# Altium project ADS1274.PrjPcb
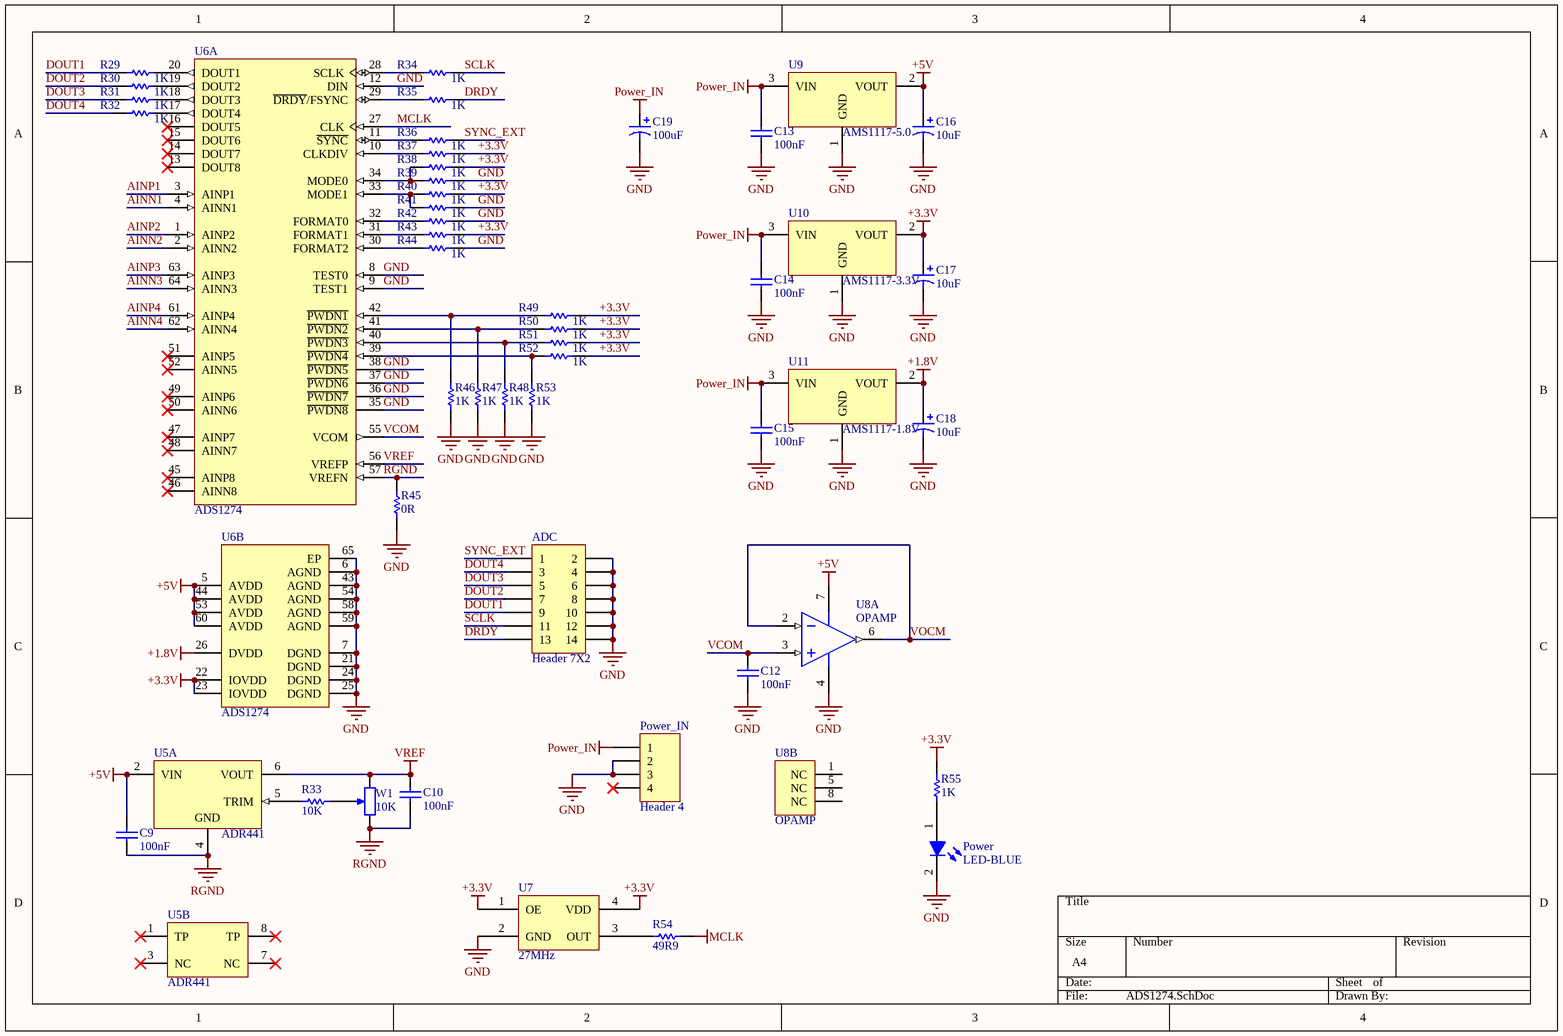
[diagram p0: ADS1274.SchDoc]
3 sheets, 108 parts. Net scope: global (net labels, ports and power ports of the same name join across sheets).
Board file: ADS1274.PcbDoc
Sheets:
  ADS1274.SchDoc
  Diff AMP Inputs.SchDoc
  Decoupling Caps.SchDoc

## Sheet ADS1274.SchDoc
size A4

### Parts
ADC  Header 7X2  [HEADER7X2]
C9  100nF  [CAPC0603(1608)55_M]
C10  100nF  [CAPC0603(1608)55_M]
C12  100nF  [CAPC0603(1608)55_M]
C13  100nF  [CAPC0603(1608)55_M]
C14  100nF  [CAPC0603(1608)55_M]
C15  100nF  [CAPC0603(1608)55_M]
C16  10uF  [CAPC3528]
C17  10uF  [CAPC3528]
C18  10uF  [CAPC3528]
C19  100uF  [CAPC7343]
Power  LED-BLUE  [0603LED_BLUE_V]
Power_IN  Header 4  [3.96-4]
R29  1K  [RESC0603(1608)_M]
R30  1K  [RESC0603(1608)_M]
R31  1K  [RESC0603(1608)_M]
R32  1K  [RESC0603(1608)_M]
R33  10K  [RESC0603(1608)_M]
R34  1K  [RESC0603(1608)_M]
R35  1K  [RESC0603(1608)_M]
R36  1K  [RESC0603(1608)_M]
R37  1K  [RESC0603(1608)_M]
R38  1K  [RESC0603(1608)_M]
R39  1K  [RESC0603(1608)_M]
R40  1K  [RESC0603(1608)_M]
R41  1K  [RESC0603(1608)_M]
R42  1K  [RESC0603(1608)_M]
R43  1K  [RESC0603(1608)_M]
R44  1K  [RESC0603(1608)_M]
R45  0R  [RESC0603(1608)_M]
R46  1K  [RESC0603(1608)_M]
R47  1K  [RESC0603(1608)_M]
R48  1K  [RESC0603(1608)_M]
R49  1K  [RESC0603(1608)_M]
R50  1K  [RESC0603(1608)_M]
R51  1K  [RESC0603(1608)_M]
R52  1K  [RESC0603(1608)_M]
R53  1K  [RESC0603(1608)_M]
R54  49R9  [RESC0603(1608)_M]
R55  1K  [RESC0603(1608)_M]
U5  ADR441  [SOIC8]  (parts A,B of 2)
U6  ADS1274  [EQFP64]  (parts A,B of 2)
U7  27MHz  [SMD7050]
U8  OPAMP  [SOIC8]  (parts A,B of 2)
U9  AMS1117-5.0  [SOT-223_M]
U10  AMS1117-3.3V  [SOT-223_M]
U11  AMS1117-1.8V  [SOT-223_M]
W1  10K  [VR5]

### Nets
+1.8V: C18.1 U6.26(DVDD) U11.2(VOUT)
+3.3V: C17.1 R37.2 R38.2 R40.2 R43.2 R49.2 R50.2 R51.2 R52.2 R55.2 U6.22(IOVDD) U6.23(IOVDD) U7.1(OE) U7.4(VDD) U10.2(VOUT)
+5V: C9.2 C16.1 U5.2(VIN) U6.5(AVDD) U6.44(AVDD) U6.53(AVDD) U6.60(AVDD) U8.7(V+) U9.2(VOUT)
GND: ADC.2 ADC.4 ADC.6 ADC.8 ADC.10 ADC.12 ADC.14 C12.1 C13.1 C14.1 C15.1 C16.2 C17.2 C18.2 C19.2 Power.2(K) Power_IN.2 Power_IN.3 R39.2 R41.2 R42.2 R44.2 R45.1 R46.1 R47.1 R48.1 R53.1 U6.6(AGND) U6.7(DGND) U6.8(TEST0) U6.9(TEST1) U6.12(DIN) U6.21(DGND) U6.24(DGND) U6.25(DGND) U6.35(~{PWDN8}) U6.36(~{PWDN7}) U6.37(~{PWDN6}) U6.38(~{PWDN5}) U6.43(AGND) U6.54(AGND) U6.58(AGND) U6.59(AGND) U6.65(EP) U7.2(GND) U8.4(V-) U9.1(GND) U10.1(GND) U11.1(GND)
MCLK: R54.2 U6.27(CLK)
Power_IN: C13.2 C14.2 C15.2 C19.1 Power_IN.1 U9.3(VIN) U10.3(VIN) U11.3(VIN)
RGND: C9.1 C10.1 R45.2 U5.4(GND) U6.57(VREFN) W1.3(BOT)
VOCM: U8.2(IN-) U8.6(OUT)
VREF: C10.2 U5.6(VOUT) U6.56(VREFP) W1.1(TOP)
AINN1: U6.4(AINN1)
AINN2: U6.2(AINN2)
AINN3: U6.64(AINN3)
AINN4: U6.62(AINN4)
AINP1: U6.3(AINP1)
AINP2: U6.1(AINP2)
AINP3: U6.63(AINP3)
AINP4: U6.61(AINP4)
DOUT1: ADC.9 R29.1
DOUT2: ADC.7 R30.1
DOUT3: ADC.5 R31.1
DOUT4: ADC.3 R32.1
DRDY: ADC.13 R35.2
SCLK: ADC.11 R34.2
SYNC_EXT: ADC.1 R36.2
VCOM: C12.2 U6.55(VCOM) U8.3(IN+)
NetPower_1: Power.1(A) R55.1
NetR29_2: R29.2 U6.20(DOUT1)
NetR30_2: R30.2 U6.19(DOUT2)
NetR31_2: R31.2 U6.18(DOUT3)
NetR32_2: R32.2 U6.17(DOUT4)
NetR33_1: R33.1 U5.5(TRIM)
NetR33_2: R33.2 W1.2(TAP)
NetR34_1: R34.1 U6.28(SCLK)
NetR35_1: R35.1 U6.29(~{DRDY}/FSYNC)
NetR36_1: R36.1 U6.11(~{SYNC})
NetR37_1: R37.1 U6.10(CLKDIV)
NetR38_1: R38.1 R39.1 U6.34(MODE0)
NetR40_1: R40.1 R41.1 U6.33(MODE1)
NetR42_1: R42.1 U6.32(FORMAT0)
NetR43_1: R43.1 U6.31(FORMAT1)
NetR44_1: R44.1 U6.30(FORMAT2)
NetR46_2: R46.2 R49.1 U6.42(~{PWDN1})
NetR47_2: R47.2 R50.1 U6.41(~{PWDN2})
NetR48_2: R48.2 R51.1 U6.40(~{PWDN3})
NetR52_1: R52.1 R53.2 U6.39(~{PWDN4})
NetR54_1: R54.1 U7.3(OUT)

Not connected (* = marked no-connect by the designer): Power_IN 4*; U5 1(TP)* 3(NC)* 7(NC)* 8(TP)*; U6 13(DOUT8)* 14(DOUT7)* 15(DOUT6)* 16(DOUT5)* 45(AINP8)* 46(AINN8)* 47(AINP7)* 48(AINN7)* 49(AINP6)* 50(AINN6)* 51(AINP5)* 52(AINN5)*; U8 1(NC) 5(NC) 8(NC)

### Library data of the parts
ADC = Header 7X2: Header, 7-Pin, Dual row; LatestRevisionDate: 17-Jul-2002; LatestRevisionNote: Re-released for DXP Platform.; Publisher: Altium Limited
C9 C10 C12-C15 = CAP
C16-C19 = CAP-Pol
Power_IN = Header 4: Header, 4-Pin; LatestRevisionDate: 17-Jul-2002; LatestRevisionNote: Re-released for DXP Platform.; Publisher: Altium Limited
R29-R55 = RES
U5 = ADR421
U7 = OSC7050
U9-U11 = AMS1117
W1 = RPot2: Potentiometer; Manufacturer: Generic Components; Class: Passive; Set Position: 0.5; Value: 1K; Published: 08/06/2000; Publisher: Altium Hobart Technology Centre; SubClass: Potentiometer

## Sheet Diff AMP Inputs.SchDoc
size A4
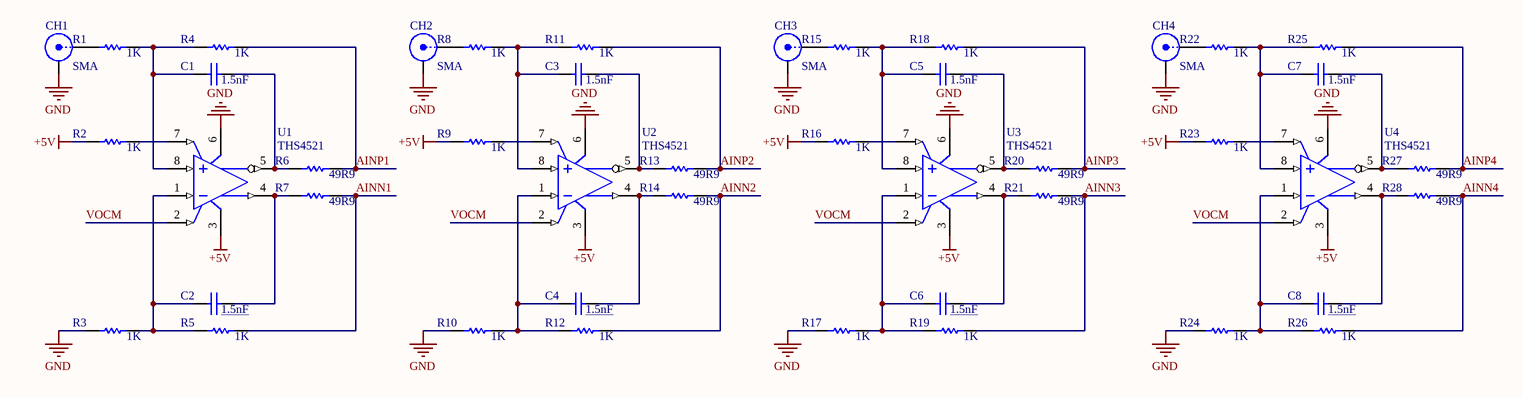
[diagram p1: Diff AMP Inputs.SchDoc]

### Parts
C1  1.5nF  [CAPC0603(1608)55_M]
C2  1.5nF  [CAPC0603(1608)55_M]
C3  1.5nF  [CAPC0603(1608)55_M]
C4  1.5nF  [CAPC0603(1608)55_M]
C5  1.5nF  [CAPC0603(1608)55_M]
C6  1.5nF  [CAPC0603(1608)55_M]
C7  1.5nF  [CAPC0603(1608)55_M]
C8  1.5nF  [CAPC0603(1608)55_M]
CH1  SMA  [SMA-V]
CH2  SMA  [SMA-V]
CH3  SMA  [SMA-V]
CH4  SMA  [SMA-V]
R1  1K  [RESC0603(1608)_M]
R2  1K  [RESC0603(1608)_M]
R3  1K  [RESC0603(1608)_M]
R4  1K  [RESC0603(1608)_M]
R5  1K  [RESC0603(1608)_M]
R6  49R9  [RESC0603(1608)_M]
R7  49R9  [RESC0603(1608)_M]
R8  1K  [RESC0603(1608)_M]
R9  1K  [RESC0603(1608)_M]
R10  1K  [RESC0603(1608)_M]
R11  1K  [RESC0603(1608)_M]
R12  1K  [RESC0603(1608)_M]
R13  49R9  [RESC0603(1608)_M]
R14  49R9  [RESC0603(1608)_M]
R15  1K  [RESC0603(1608)_M]
R16  1K  [RESC0603(1608)_M]
R17  1K  [RESC0603(1608)_M]
R18  1K  [RESC0603(1608)_M]
R19  1K  [RESC0603(1608)_M]
R20  49R9  [RESC0603(1608)_M]
R21  49R9  [RESC0603(1608)_M]
R22  1K  [RESC0603(1608)_M]
R23  1K  [RESC0603(1608)_M]
R24  1K  [RESC0603(1608)_M]
R25  1K  [RESC0603(1608)_M]
R26  1K  [RESC0603(1608)_M]
R27  49R9  [RESC0603(1608)_M]
R28  49R9  [RESC0603(1608)_M]
U1  THS4521  [SOIC8]
U2  THS4521  [SOIC8]
U3  THS4521  [SOIC8]
U4  THS4521  [SOIC8]

### Nets
+5V: R2.1 R9.1 R16.1 R23.1 U1.3(VS+) U2.3(VS+) U3.3(VS+) U4.3(VS+)
GND: CH1.2(Y) CH2.2(Y) CH3.2(Y) CH4.2(Y) R3.1 R10.1 R17.1 R24.1 U1.6(VS-) U2.6(VS-) U3.6(VS-) U4.6(VS-)
VOCM: U1.2(VOCM) U2.2(VOCM) U3.2(VOCM) U4.2(VOCM)
AINN1: R5.2 R7.2
AINN2: R12.2 R14.2
AINN3: R19.2 R21.2
AINN4: R26.2 R28.2
AINP1: R4.2 R6.2
AINP2: R11.2 R13.2
AINP3: R18.2 R20.2
AINP4: R25.2 R27.2
NetC1_1: C1.1 R1.2 R4.1 U1.8(VIN+)
NetC1_2: C1.2 R6.1 U1.5(VOUT-)
NetC2_1: C2.1 R3.2 R5.1 U1.1(VIN-)
NetC2_2: C2.2 R7.1 U1.4(VOUT+)
NetC3_1: C3.1 R8.2 R11.1 U2.8(VIN+)
NetC3_2: C3.2 R13.1 U2.5(VOUT-)
NetC4_1: C4.1 R10.2 R12.1 U2.1(VIN-)
NetC4_2: C4.2 R14.1 U2.4(VOUT+)
NetC5_1: C5.1 R15.2 R18.1 U3.8(VIN+)
NetC5_2: C5.2 R20.1 U3.5(VOUT-)
NetC6_1: C6.1 R17.2 R19.1 U3.1(VIN-)
NetC6_2: C6.2 R21.1 U3.4(VOUT+)
NetC7_1: C7.1 R22.2 R25.1 U4.8(VIN+)
NetC7_2: C7.2 R27.1 U4.5(VOUT-)
NetC8_1: C8.1 R24.2 R26.1 U4.1(VIN-)
NetC8_2: C8.2 R28.1 U4.4(VOUT+)
NetCH1_1: CH1.1(X) R1.1
NetCH2_1: CH2.1(X) R8.1
NetCH3_1: CH3.1(X) R15.1
NetCH4_1: CH4.1(X) R22.1
NetR2_2: R2.2 U1.7(~{PD})
NetR9_2: R9.2 U2.7(~{PD})
NetR16_2: R16.2 U3.7(~{PD})
NetR23_2: R23.2 U4.7(~{PD})

### Library data of the parts
C1-C8 = CAP
R1-R28 = RES
CH1-CH4 = SMA: LatestRevisionDate: 17-Jul-2002; LatestRevisionNote: Re-released for DXP Platform.; Publisher: Altium Limited

## Sheet Decoupling Caps.SchDoc
size A4
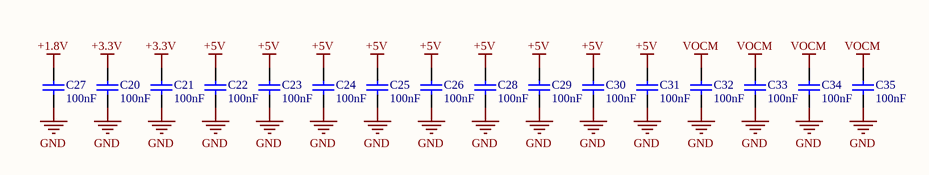
[diagram p2: Decoupling Caps.SchDoc]

### Parts
C20  100nF  [CAPC0603(1608)55_M]
C21  100nF  [CAPC0603(1608)55_M]
C22  100nF  [CAPC0603(1608)55_M]
C23  100nF  [CAPC0603(1608)55_M]
C24  100nF  [CAPC0603(1608)55_M]
C25  100nF  [CAPC0603(1608)55_M]
C26  100nF  [CAPC0603(1608)55_M]
C27  100nF  [CAPC0603(1608)55_M]
C28  100nF  [CAPC0603(1608)55_M]
C29  100nF  [CAPC0603(1608)55_M]
C30  100nF  [CAPC0603(1608)55_M]
C31  100nF  [CAPC0603(1608)55_M]
C32  100nF  [CAPC0603(1608)55_M]
C33  100nF  [CAPC0603(1608)55_M]
C34  100nF  [CAPC0603(1608)55_M]
C35  100nF  [CAPC0603(1608)55_M]

### Nets
+1.8V: C27.2
+3.3V: C20.2 C21.2
+5V: C22.2 C23.2 C24.2 C25.2 C26.2 C28.2 C29.2 C30.2 C31.2
GND: C20.1 C21.1 C22.1 C23.1 C24.1 C25.1 C26.1 C27.1 C28.1 C29.1 C30.1 C31.1 C32.1 C33.1 C34.1 C35.1
VOCM: C32.2 C33.2 C34.2 C35.2

### Library data of the parts
C20-C35 = CAP

## Nets that join several sheets
+1.8V: ADS1274 (C18.1 U6.26 U11.2), Decoupling Caps (C27.2)
+3.3V: ADS1274 (15 pins), Decoupling Caps (C20.2 C21.2)
+5V: ADS1274 (9 pins), Diff AMP Inputs (8 pins), Decoupling Caps (9 pins)
GND: ADS1274 (49 pins), Diff AMP Inputs (12 pins), Decoupling Caps (16 pins)
VOCM: ADS1274 (U8.2 U8.6), Diff AMP Inputs (U1.2 U2.2 U3.2 U4.2), Decoupling Caps (C32.2 C33.2 C34.2 C35.2)
AINN1: ADS1274 (U6.4), Diff AMP Inputs (R5.2 R7.2)
AINN2: ADS1274 (U6.2), Diff AMP Inputs (R12.2 R14.2)
AINN3: ADS1274 (U6.64), Diff AMP Inputs (R19.2 R21.2)
AINN4: ADS1274 (U6.62), Diff AMP Inputs (R26.2 R28.2)
AINP1: ADS1274 (U6.3), Diff AMP Inputs (R4.2 R6.2)
AINP2: ADS1274 (U6.1), Diff AMP Inputs (R11.2 R13.2)
AINP3: ADS1274 (U6.63), Diff AMP Inputs (R18.2 R20.2)
AINP4: ADS1274 (U6.61), Diff AMP Inputs (R25.2 R27.2)